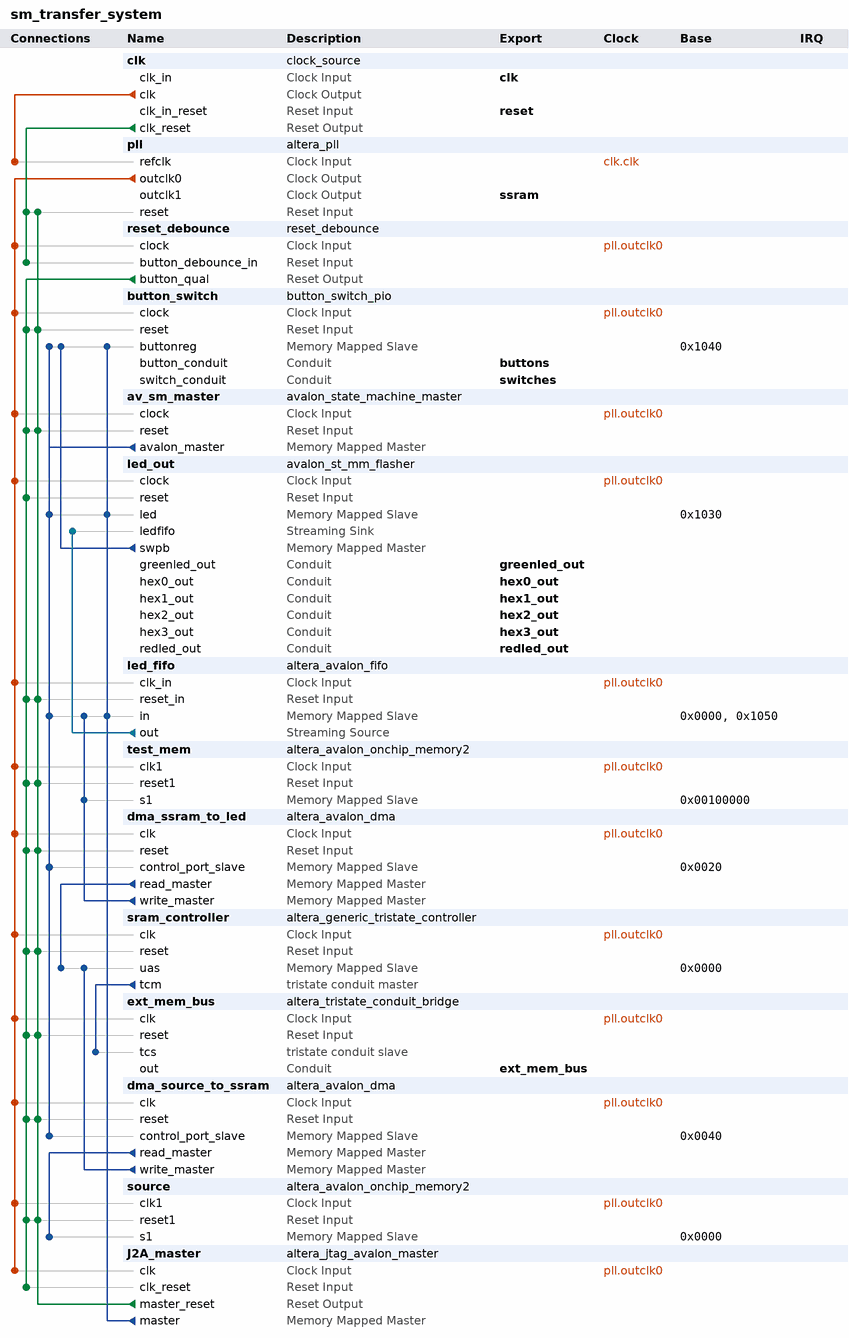
[diagram p0: system contents]
# Platform Designer (Qsys) system sm_transfer_system, Cyclone V 5CGXFC5C6F27C7
# Parameters at their usual value, and those the tool derives, are not listed.
package require -exact qsys 22.1
create_system sm_transfer_system
set_project_property DEVICE_FAMILY {Cyclone V}
set_project_property DEVICE 5CGXFC5C6F27C7

add_instance clk clock_source 22.1
set_instance_parameter_value clk clockFrequency 50000000

add_instance pll altera_pll 22.1
set_instance_parameter_value pll gui_device_speed_grade 2
set_instance_parameter_value pll gui_number_of_clocks 2
set_instance_parameter_value pll gui_operation_mode normal
set_instance_parameter_value pll gui_output_clock_frequency0 100.0
set_instance_parameter_value pll gui_output_clock_frequency1 100.0
set_instance_parameter_value pll gui_phase_shift1 -3320
set_instance_parameter_value pll gui_pll_mode {Integer-N PLL}
set_instance_parameter_value pll gui_reference_clock_frequency 50.0
set_instance_parameter_value pll gui_use_locked true

add_instance reset_debounce reset_debounce 1.0

add_instance button_switch button_switch_pio 1.0
set_instance_parameter_value button_switch BUTTON_WIDTH 4
set_instance_parameter_value button_switch SWITCH_WIDTH 10

add_instance av_sm_master avalon_state_machine_master 2.0
set_instance_parameter_value av_sm_master avalon_commands {idle; write 00 FF; write 00 FF;  write 00 F3;  write 00 FC;  read 1040;  testbit 0 0;  read 1040;  testbit 0 1;  write 00 F1;  write 00 F2;  write 00 F4;  write 00 F8; write 40 00; write 44 00; write 48 00; write 4C 40; write 58 8C; read  40;  testbit 0 1;  write 00 FA;  write 00 F5; read  1040;  testbit 0 0;  read  1040;  testbit 0 1;  write 00 F1;  write 00 F2;  write 00 F4;  write 00 F8; write 20 00; write 24 00; write 28 00; write 2C 40; write 38 28C; read  20;  testbit 0 1; write 20 00; write 24 00; write 28 10000; write 2C 40; write 38 8C; read  20;  testbit 0 1;  read  1040;  testbit 1 0;  read  1040;  testbit 1 1;  write 00 F8;  write 00 F4;  write 00 F2;  write 00 F1; loop 0}

add_instance led_out avalon_st_mm_flasher 1.0
set_instance_parameter_value led_out COUNT_MAX 83886079
set_instance_parameter_value led_out GREEN_WIDTH 8
set_instance_parameter_value led_out RED_WIDTH 10

add_instance led_fifo altera_avalon_fifo 22.1
set_instance_parameter_value led_fifo bitsPerSymbol 32
set_instance_parameter_value led_fifo channelWidth 0
set_instance_parameter_value led_fifo errorWidth 0
set_instance_parameter_value led_fifo fifoDepth 4096
set_instance_parameter_value led_fifo fifoInputInterfaceOptions AVALONMM_WRITE
set_instance_parameter_value led_fifo fifoOutputInterfaceOptions AVALONST_SOURCE
set_instance_parameter_value led_fifo singleClockMode true
set_instance_parameter_value led_fifo singleResetMode true
set_instance_parameter_value led_fifo symbolsPerBeat 1
set_instance_parameter_value led_fifo useIRQ true
set_instance_parameter_value led_fifo usePacket false
set_instance_parameter_value led_fifo useReadControl false
set_instance_parameter_value led_fifo useWriteControl false

add_instance test_mem altera_avalon_onchip_memory2 22.1
set_instance_parameter_value test_mem allowInSystemMemoryContentEditor true
set_instance_parameter_value test_mem dataWidth 32
set_instance_parameter_value test_mem dualPort false
set_instance_parameter_value test_mem initMemContent false
set_instance_parameter_value test_mem initializationFileName test_mem
set_instance_parameter_value test_mem instanceID DCBA
set_instance_parameter_value test_mem memorySize 8192
set_instance_parameter_value test_mem resetrequest_enabled false

add_instance dma_ssram_to_led altera_avalon_dma 22.1
set_instance_parameter_value dma_ssram_to_led allowByteTransactions true
set_instance_parameter_value dma_ssram_to_led allowDoubleWordTransactions true
set_instance_parameter_value dma_ssram_to_led allowHalfWordTransactions true
set_instance_parameter_value dma_ssram_to_led allowQuadWordTransactions true
set_instance_parameter_value dma_ssram_to_led burstEnable false
set_instance_parameter_value dma_ssram_to_led fifoDepth 32
set_instance_parameter_value dma_ssram_to_led maxBurstSize 1
set_instance_parameter_value dma_ssram_to_led minimumDmaTransactionRegisterWidth 13
set_instance_parameter_value dma_ssram_to_led useRegistersForFIFO true

add_instance sram_controller altera_generic_tristate_controller 22.1
set_instance_parameter_value sram_controller ACTIVE_LOW_BEGINTRANSFER 0
set_instance_parameter_value sram_controller ACTIVE_LOW_BYTEENABLE 1
set_instance_parameter_value sram_controller ACTIVE_LOW_OUTPUTENABLE 1
set_instance_parameter_value sram_controller ACTIVE_LOW_READ 0
set_instance_parameter_value sram_controller CHIPSELECT_THROUGH_READLATENCY 0
set_instance_parameter_value sram_controller INTERFACE_ASSIGNMENT_KEYS embeddedsw.configuration.isMemoryDevice
set_instance_parameter_value sram_controller INTERFACE_ASSIGNMENT_VALUES 1
set_instance_parameter_value sram_controller MODULE_ASSIGNMENT_KEYS embeddedsw.configuration.isMemoryDevice,embeddedsw.configuration.hwClassnameDriverSupportList,postgeneration.simulation.init_file.param_name,postgeneration.simulation.init_file.type,postgeneration.simulation.init_file.param_owner
set_instance_parameter_value sram_controller MODULE_ASSIGNMENT_VALUES "1,altera_avalon_lan91c111\\,altera_avalon_cfi_flash,INIT_FILE,MEM_INIT,tcm"
set_instance_parameter_value sram_controller TCM_ADDRESS_W 18
set_instance_parameter_value sram_controller TCM_BYTEENABLE_W 2
set_instance_parameter_value sram_controller TCM_DATA_HOLD 10
set_instance_parameter_value sram_controller TCM_DATA_W 16
set_instance_parameter_value sram_controller TCM_MAX_PENDING_READ_TRANSACTIONS 3
set_instance_parameter_value sram_controller TCM_READLATENCY 2
set_instance_parameter_value sram_controller TCM_READ_WAIT 10
set_instance_parameter_value sram_controller TCM_SETUP_WAIT 10
set_instance_parameter_value sram_controller TCM_SYMBOLS_PER_WORD 2
set_instance_parameter_value sram_controller TCM_TIMING_UNITS 0
set_instance_parameter_value sram_controller TCM_TURNAROUND_TIME 2
set_instance_parameter_value sram_controller TCM_WRITE_WAIT 10
set_instance_parameter_value sram_controller USE_BEGINTRANSFER 0
set_instance_parameter_value sram_controller USE_BYTEENABLE 1
set_instance_parameter_value sram_controller USE_OUTPUTENABLE 1
set_instance_parameter_value sram_controller USE_READ 0

add_instance ext_mem_bus altera_tristate_conduit_bridge 22.1

add_instance dma_source_to_ssram altera_avalon_dma 22.1
set_instance_parameter_value dma_source_to_ssram allowByteTransactions true
set_instance_parameter_value dma_source_to_ssram allowDoubleWordTransactions true
set_instance_parameter_value dma_source_to_ssram allowHalfWordTransactions true
set_instance_parameter_value dma_source_to_ssram allowQuadWordTransactions true
set_instance_parameter_value dma_source_to_ssram burstEnable false
set_instance_parameter_value dma_source_to_ssram fifoDepth 32
set_instance_parameter_value dma_source_to_ssram maxBurstSize 1
set_instance_parameter_value dma_source_to_ssram minimumDmaTransactionRegisterWidth 13
set_instance_parameter_value dma_source_to_ssram useRegistersForFIFO true

add_instance source altera_avalon_onchip_memory2 22.1
set_instance_parameter_value source allowInSystemMemoryContentEditor true
set_instance_parameter_value source dataWidth 32
set_instance_parameter_value source dualPort false
set_instance_parameter_value source initMemContent true
set_instance_parameter_value source initializationFileName source
set_instance_parameter_value source instanceID ABCD
set_instance_parameter_value source memorySize 8192
set_instance_parameter_value source resetrequest_enabled false
set_instance_parameter_value source useNonDefaultInitFile true
set_instance_parameter_value source writable false

add_instance J2A_master altera_jtag_avalon_master 22.1

# connections
add_connection clk.clk pll.refclk clock
add_connection pll.outclk0 av_sm_master.clock clock
add_connection pll.outclk0 button_switch.clock clock
add_connection pll.outclk0 dma_source_to_ssram.clk clock
add_connection pll.outclk0 dma_ssram_to_led.clk clock
add_connection pll.outclk0 ext_mem_bus.clk clock
add_connection pll.outclk0 J2A_master.clk clock
add_connection pll.outclk0 led_fifo.clk_in clock
add_connection pll.outclk0 led_out.clock clock
add_connection pll.outclk0 reset_debounce.clock clock
add_connection pll.outclk0 source.clk1 clock
add_connection pll.outclk0 sram_controller.clk clock
add_connection pll.outclk0 test_mem.clk1 clock
add_connection clk.clk_reset pll.reset reset
add_connection clk.clk_reset reset_debounce.button_debounce_in reset
add_connection J2A_master.master_reset av_sm_master.reset reset
add_connection J2A_master.master_reset button_switch.reset reset
add_connection J2A_master.master_reset dma_source_to_ssram.reset reset
add_connection J2A_master.master_reset dma_ssram_to_led.reset reset
add_connection J2A_master.master_reset ext_mem_bus.reset reset
add_connection J2A_master.master_reset led_fifo.reset_in reset
add_connection J2A_master.master_reset pll.reset reset
add_connection J2A_master.master_reset source.reset1 reset
add_connection J2A_master.master_reset sram_controller.reset reset
add_connection J2A_master.master_reset test_mem.reset1 reset
add_connection reset_debounce.button_qual av_sm_master.reset reset
add_connection reset_debounce.button_qual button_switch.reset reset
add_connection reset_debounce.button_qual dma_source_to_ssram.reset reset
add_connection reset_debounce.button_qual dma_ssram_to_led.reset reset
add_connection reset_debounce.button_qual ext_mem_bus.reset reset
add_connection reset_debounce.button_qual J2A_master.clk_reset reset
add_connection reset_debounce.button_qual led_fifo.reset_in reset
add_connection reset_debounce.button_qual led_out.reset reset
add_connection reset_debounce.button_qual source.reset1 reset
add_connection reset_debounce.button_qual sram_controller.reset reset
add_connection reset_debounce.button_qual test_mem.reset1 reset
add_connection av_sm_master.avalon_master button_switch.buttonreg avalon
set_connection_parameter_value av_sm_master.avalon_master/button_switch.buttonreg baseAddress 0x1040
add_connection av_sm_master.avalon_master dma_source_to_ssram.control_port_slave avalon
set_connection_parameter_value av_sm_master.avalon_master/dma_source_to_ssram.control_port_slave baseAddress 0x0040
add_connection av_sm_master.avalon_master dma_ssram_to_led.control_port_slave avalon
set_connection_parameter_value av_sm_master.avalon_master/dma_ssram_to_led.control_port_slave baseAddress 0x0020
add_connection av_sm_master.avalon_master led_fifo.in avalon
set_connection_parameter_value av_sm_master.avalon_master/led_fifo.in baseAddress 0x0000
add_connection av_sm_master.avalon_master led_out.led avalon
set_connection_parameter_value av_sm_master.avalon_master/led_out.led baseAddress 0x1030
add_connection dma_source_to_ssram.read_master source.s1 avalon
set_connection_parameter_value dma_source_to_ssram.read_master/source.s1 baseAddress 0x0000
add_connection dma_source_to_ssram.write_master sram_controller.uas avalon
set_connection_parameter_value dma_source_to_ssram.write_master/sram_controller.uas baseAddress 0x0000
add_connection dma_ssram_to_led.read_master sram_controller.uas avalon
set_connection_parameter_value dma_ssram_to_led.read_master/sram_controller.uas baseAddress 0x0000
add_connection dma_ssram_to_led.write_master led_fifo.in avalon
set_connection_parameter_value dma_ssram_to_led.write_master/led_fifo.in baseAddress 0x0000
add_connection dma_ssram_to_led.write_master test_mem.s1 avalon
set_connection_parameter_value dma_ssram_to_led.write_master/test_mem.s1 baseAddress 0x00100000
add_connection J2A_master.master button_switch.buttonreg avalon
set_connection_parameter_value J2A_master.master/button_switch.buttonreg baseAddress 0x1040
add_connection J2A_master.master led_fifo.in avalon
set_connection_parameter_value J2A_master.master/led_fifo.in baseAddress 0x1050
add_connection J2A_master.master led_out.led avalon
set_connection_parameter_value J2A_master.master/led_out.led baseAddress 0x1030
add_connection led_out.swpb button_switch.buttonreg avalon
set_connection_parameter_value led_out.swpb/button_switch.buttonreg baseAddress 0x1040
add_connection led_fifo.out led_out.ledfifo avalon_streaming
add_connection sram_controller.tcm ext_mem_bus.tcs tristate_conduit

# exported interfaces
add_interface buttons conduit end
set_interface_property buttons EXPORT_OF button_switch.button_conduit
add_interface clk clock sink
set_interface_property clk EXPORT_OF clk.clk_in
add_interface ext_mem_bus conduit end
set_interface_property ext_mem_bus EXPORT_OF ext_mem_bus.out
add_interface greenled_out conduit end
set_interface_property greenled_out EXPORT_OF led_out.greenled_out
add_interface hex0_out conduit end
set_interface_property hex0_out EXPORT_OF led_out.hex0_out
add_interface hex1_out conduit end
set_interface_property hex1_out EXPORT_OF led_out.hex1_out
add_interface hex2_out conduit end
set_interface_property hex2_out EXPORT_OF led_out.hex2_out
add_interface hex3_out conduit end
set_interface_property hex3_out EXPORT_OF led_out.hex3_out
add_interface redled_out conduit end
set_interface_property redled_out EXPORT_OF led_out.redled_out
add_interface reset reset sink
set_interface_property reset EXPORT_OF clk.clk_in_reset
add_interface ssram clock source
set_interface_property ssram EXPORT_OF pll.outclk1
add_interface switches conduit end
set_interface_property switches EXPORT_OF button_switch.switch_conduit

set_interconnect_requirement {$system} qsys_mm.clockCrossingAdapter HANDSHAKE
set_interconnect_requirement {$system} qsys_mm.enableInstrumentation FALSE
set_interconnect_requirement {$system} qsys_mm.maxAdditionalLatency 2
set_interconnect_requirement av_sm_master.avalon_master qsys_mm.insertPerformanceMonitor TRUE

save_system sm_transfer_system.qsys
